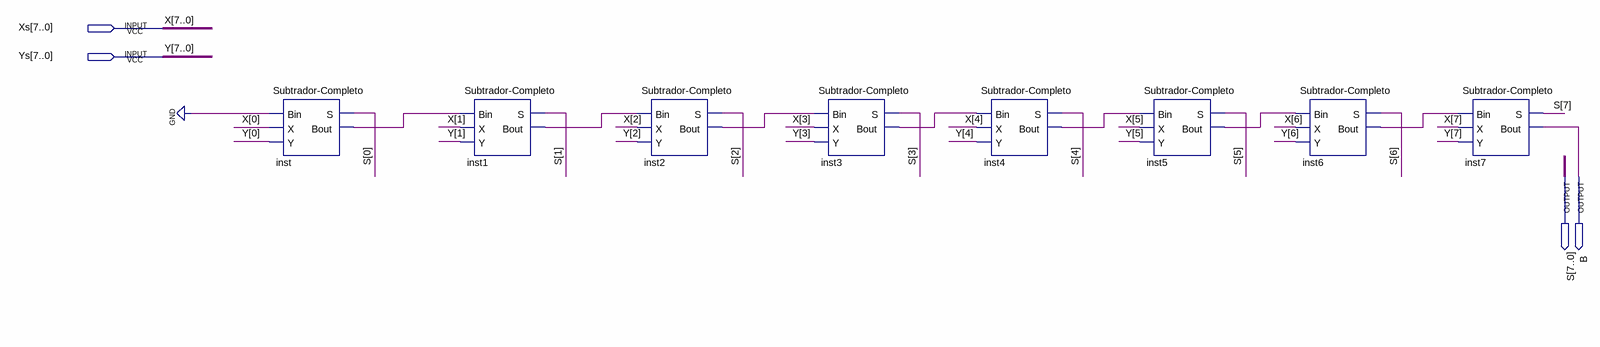
[diagram p0: schematic sheet]
// Quartus schematic Subtrador-8b.bdf as structural Verilog: 8 symbols, 4 pins
module \Subtrador-8b  (
  input  [7:0] Xs,
  input  [7:0] Ys,
  output [7:0] S,
  output B
);

  wire inst1_bout, inst2_bout, inst3_bout, inst4_bout, inst5_bout, inst6_bout, inst_bout;

  \Subtrador-Completo  inst (.Bin(1'b0), .X(Xs[0]), .Y(Ys[0]), .S(S[0]), .Bout(inst_bout));
  \Subtrador-Completo  inst1 (.Bin(inst_bout), .X(Xs[1]), .Y(Ys[1]), .S(S[1]), .Bout(inst1_bout));
  \Subtrador-Completo  inst2 (.Bin(inst1_bout), .X(Xs[2]), .Y(Ys[2]), .S(S[2]), .Bout(inst2_bout));
  \Subtrador-Completo  inst3 (.Bin(inst2_bout), .X(Xs[3]), .Y(Ys[3]), .S(S[3]), .Bout(inst3_bout));
  \Subtrador-Completo  inst4 (.Bin(inst3_bout), .X(Xs[4]), .Y(Ys[4]), .S(S[4]), .Bout(inst4_bout));
  \Subtrador-Completo  inst5 (.Bin(inst4_bout), .X(Xs[5]), .Y(Ys[5]), .S(S[5]), .Bout(inst5_bout));
  \Subtrador-Completo  inst6 (.Bin(inst5_bout), .X(Xs[6]), .Y(Ys[6]), .S(S[6]), .Bout(inst6_bout));
  \Subtrador-Completo  inst7 (.Bin(inst6_bout), .X(Xs[7]), .Y(Ys[7]), .S(S[7]), .Bout(B));

  // Other names for the same wires on the sheet: X[7:0] = Xs; Y[7:0] = Ys
endmodule
